# Altium schematic sheet 2. 4G.SchDoc
size A3
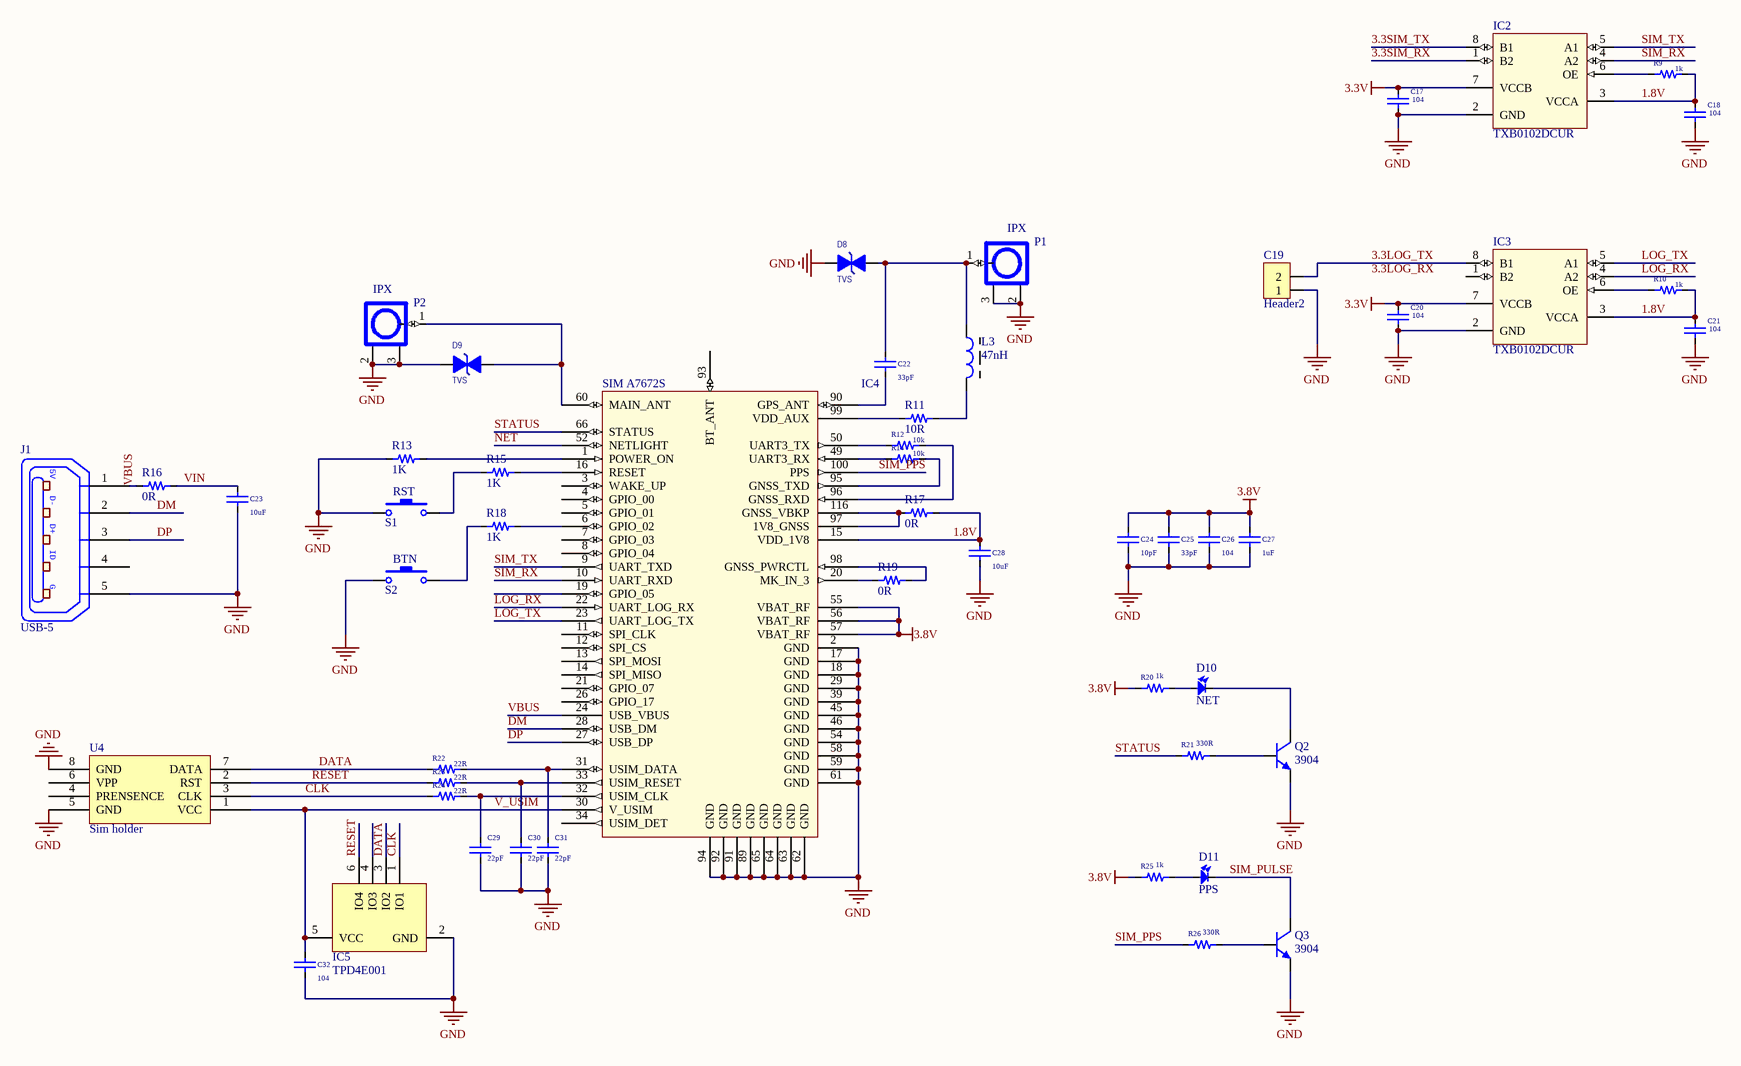
[diagram p0: 2. 4G.SchDoc]

## Parts
C17  104  [CAP_0603]
C18  104  [CAP_0603]
C19  Header2  [JP2]
C20  104  [CAP_0603]
C21  104  [CAP_0603]
C22  33pF  [CAP_0603]
C23  10uF  [CAP_0603]
C24  10pF  [CAP_0603]
C25  33pF  [CAP_0603]
C26  104  [CAP_0603]
C27  1uF  [CAP_0603]
C28  10uF  [CAP_0603]
C29  22pF  [CAP_0603]
C30  22pF  [CAP_0603]
C31  22pF  [CAP_0603]
C32  104  [CAP_0603]
D8  TVS  [RES-SMD-0402]
D9  TVS  [RES-SMD-0402]
D10  NET  [LED-3]
D11  PPS  [LED-0603-Red]
IC2  TXB0102DCUR  [TXB0102DCUR]
IC3  TXB0102DCUR  [TXB0102DCUR]
IC4  SIM A7672S  [SIM A7672S]
IC5  TPD4E001  [TPD4E001]
J1  USB-5  [MICROUSB]
L3  47nH  [RES-SMD-0603]
P1  IPX  [IPXS]
P2  IPX  [IPXS]
Q2  3904  [MMBT3904]
Q3  3904  [MMBT3904]
R9  1k  [RES-SMD-0603]
R10  1k  [RES-SMD-0603]
R11  10R  [RES-SMD-0603]
R12  10k  [RES-SMD-0603]
R13  1K  [RES-SMD-0603]
R14  10k  [RES-SMD-0603]
R15  1K  [RES-SMD-0603]
R16  0R  [RES-SMD-0603]
R17  0R  [RES-SMD-0603]
R18  1K  [RES-SMD-0603]
R19  0R  [RES-SMD-0603]
R20  1k  [RES-SMD-0603]
R21  330R  [RES-SMD-0603]
R22  22R  [RES-SMD-0603]
R23  22R  [RES-SMD-0603]
R24  22R  [RES-SMD-0603]
R25  1k  [RES-SMD-0603]
R26  330R  [RES-SMD-0603]
S1  RST  [SW-SMD]
S2  BTN  [SW-SMD]
U4  Sim holder  [SIM_MicroSIM 6P Flip]

## Nets
3.3V: C17.2 C20.2 IC2.7(VCCB) IC3.7(VCCB)
3.8V: C24.2 C25.2 C26.2 C27.2 IC4.55(VBAT_RF) IC4.56(VBAT_RF) IC4.57(VBAT_RF) R20.2 R25.2
GND: C17.1 C18.1 C19.1 C20.1 C21.1 C23.1 C24.1 C25.1 C26.1 C27.1 C28.1 C29.1 C30.1 C31.1 C32.1 D8.2(K) D9.2(K) IC2.2(GND) IC3.2(GND) IC4.2(GND) IC4.17(GND) IC4.18(GND) IC4.29(KEYPAD_0) IC4.39(GND) IC4.45(GND) IC4.46(ADC2) IC4.54(GPIO4) IC4.58(GND) IC4.59(GND) IC4.61(GND) IC4.62(GND) IC4.63(GND) IC4.64(GND) IC4.65(GND) IC4.89(GND) IC4.91(GND) IC4.92(GND) IC4.94(GND) IC5.2(GND) J1.5(P5) P1.2 P1.3 P2.2 P2.3 Q2.2(E) Q3.2(E) R13.1 S1.1 S2.1 U4.5(GND) U4.8(GND)
1.8V: C18.2 C21.2 C28.2 IC2.3(VCCA) IC3.3(VCCA) IC4.15(RESERVED) R9.1 R10.1 R17.2
3.3LOG_TX: C19.2 IC3.8(B1)
3.3SIM_RX: IC2.1(B2)
3.3SIM_TX: IC2.8(B1)
CLK: IC5.1(IO1) R24.2 U4.3(CLK)
DATA: IC5.3(IO2) R22.2 U4.7(DATA)
DM: IC4.28(KEYSENSE_N0) J1.2(P2)
DP: IC4.27(KEYSENSE_N1) J1.3(P3)
LOG_RX: IC3.4(A2) IC4.22(SPK_P)
LOG_TX: IC3.5(A1) IC4.23(MIC1P)
NET: IC4.52(GPIO41)
RESET: IC5.6(IO4) R23.2 U4.2(RST)
SIM_PPS: IC4.100(PPS) R26.2
SIM_PULSE: D11.2 Q3.3(C)
SIM_RX: IC2.4(A2) IC4.10(UART_RXD)
SIM_TX: IC2.5(A1) IC4.9(UART_TXD)
STATUS: IC4.66(STATUS) R21.2
V_USIM: C32.2 IC4.30(KEYPAD_2) IC5.5(VCC) U4.1(VCC)
VBUS: IC4.24(MIC1N) J1.1(P1) R16.1
VIN: C23.2 R16.2
NetC22_1: C22.1 IC4.90(GPS_ANT)
NetC22_2: C22.2 D8.1(A) L3.1 P1.1
NetC29_2: C29.2 IC4.32(KEYSENSE_N3) R24.1
NetC30_2: C30.2 IC4.33(KEYPAD_1) R23.1
NetC31_2: C31.2 IC4.31(KEYSENSE_N2) R22.1
NetD9_1: D9.1(A) IC4.60(MAIN_ANT) P2.1
NetD10_1: D10.1 R20.1
NetD10_2: D10.2 Q2.3(C)
NetD11_1: D11.1 R25.1
NetIC2_6: IC2.6(OE) R9.2
NetIC3_6: IC3.6(OE) R10.2
NetIC4_1: IC4.1(POWER_ON) R13.2
NetIC4_6: IC4.6(GPIO_02) R18.1
NetIC4_16: IC4.16(RESERVED) R15.2
NetIC4_20: IC4.20(MK_IN_3) R19.1
NetIC4_49: IC4.49(GPIO40) R14.2
NetIC4_50: IC4.50(GPIO43) R12.2
NetIC4_95: IC4.95(GNSS_TXD) R14.1
NetIC4_96: IC4.96(GNSS_RXD) R12.1
NetIC4_97: IC4.97(1V8_GNSS) IC4.116(GNSS_VBKP) R17.1
NetIC4_98: IC4.98(GNSS_PWRCTL) R19.2
NetIC4_99: IC4.99(VDD_AUX) R11.1
NetL3_2: L3.2 R11.2
NetQ2_1: Q2.1(B) R21.1
NetQ3_1: Q3.1(B) R26.1
NetR15_1: R15.1 S1.2
NetR18_2: R18.2 S2.2

Not connected (* = marked no-connect by the designer): IC3 1(B2); IC4 3(WAKE_UP) 4(GPIO_00) 5(GPIO_01) 7(GPIO_03) 8(GPIO_04) 11(SPI_CLK) 12(SPI_CS) 13(SPI_MOSI) 14(SPI_MISO) 19(GPIO_05) 21(SPK_M) 25(EAR1N) 26(EAR1P) 34(KEYPAD_4) 35(KEYPAD_3) 36(KEYSENSE_N4) 47(ADC1) 48(GPIO44) 51(GPIO1) 53(GPIO42) 73(PCM_DOUT) 74(PCM_DIN) 75(PCM_SYNC) 76(PCM_CLK) 93(BT_ANT); IC5 4(IO3); J1 4(P4); U4 4(PRENSENCE) 6(VPP)

## Notes on the sheet
- Labels drawn without touching a wire or pin: 3.3LOG_RX
- (in symbol USB-5) 5V; D-; D+; ID; G

## Library data of the parts
C17 C18 C20-C32 = CapSMD: Capacitor; Value: 33p; Published: 8-Jun-2000; LatestRevisionDate: 17-Jul-2002; LatestRevisionNote: Re-released for DXP Platform.; PackageReference: RAD-0.3; Publisher: Altium Limited
C19 = Header2: Header IDC, 2 x 1 Pin Vertical 2.54mm Pitch (Non-Boxed, Male); Manufacturer: W¨¹rth Elektronik eiSos GmbH; partNo: 613002143121; ComponentLink1 Description: Manufacturer; ComponentLink2 Description: Datasheet; NoPins: 02; Created Date: 29 March 2013; ComponentLink1URL: http://www.we-online.com; ComponentLink2URL: http://katalog.we-online.de/em/datasheet/6130xx143121.pdf; Created by: Karrer Zheng
D8 D9 = TVS: TVS DIODE 4VWM 1005; Manufacturer: Murata Electronics; Part number: LXES15AAA1-153; Value: 4V; Category: Circuit Protection; Package: 0402; User_Description: TVS DIODE 4VWM 1005
D10 D11 = LED: LED Single colour Green and Red; Value: LED 3 ly Single Colour
IC2 IC3 = TXB0102DCUR: IC TRNSLTR BIDIRECTIONAL US8; Manufacturer: Texas Instruments; Category: IC Logic Level; Package: 8-VSSOP; Part number: TXB0102DCUR; User_Description: IC TRNSLTR BIDIRECTIONAL US8
IC4 = SIM A7672S: SIM A7672S-CAT-M1; Part number: SIM A7672S
IC5 = TPD4E001_1: Manufacturer: Texas Instruments; Part number: TPD4E001RDBVR; User_Description: TVS DIODE 5.5VWM SC70-6; Category: Circuit Protection; Package: SOT-363
J1 = USB-5: Manufacturer: FCI; Category: Connectors, Interconnects
L3 = Inductor Ferit: FIXED IND 47NH 300MA 700MOHM SMD; Manufacturer: Taiyo Yuden; Part number: HK160847NJ-T; Value: 150 mH; Category: INDUCTORS; Package: 0603; User_Description: FIXED IND 47NH 300MA 700MOHM SMD
P1 P2 = IPXSx66: Antenna GSM GPS; Manufacturer: TE Connectivity AMP Connectors; Part number: 2334884-1; User_Description: UMCC MICRO-COAX RECEPTACLE, GEN; Category: Connectors; Package: SMD
Q2 Q3 = MMBT3904
R9-R26 = Resistor - SMD: Resistor; Manufacturer: Generic Components; Class: Passive; Published: 08/06/2000; Publisher: Altium Hobart Technology Centre
S1 S2 = SW-SMD: Switch; Published: 24-Mar-1999; LatestRevisionDate: 17-Jul-2002; LatestRevisionNote: Re-released for DXP Platform.; PackageReference: SPST-2; Publisher: Altium Limited
U4 = Component_1